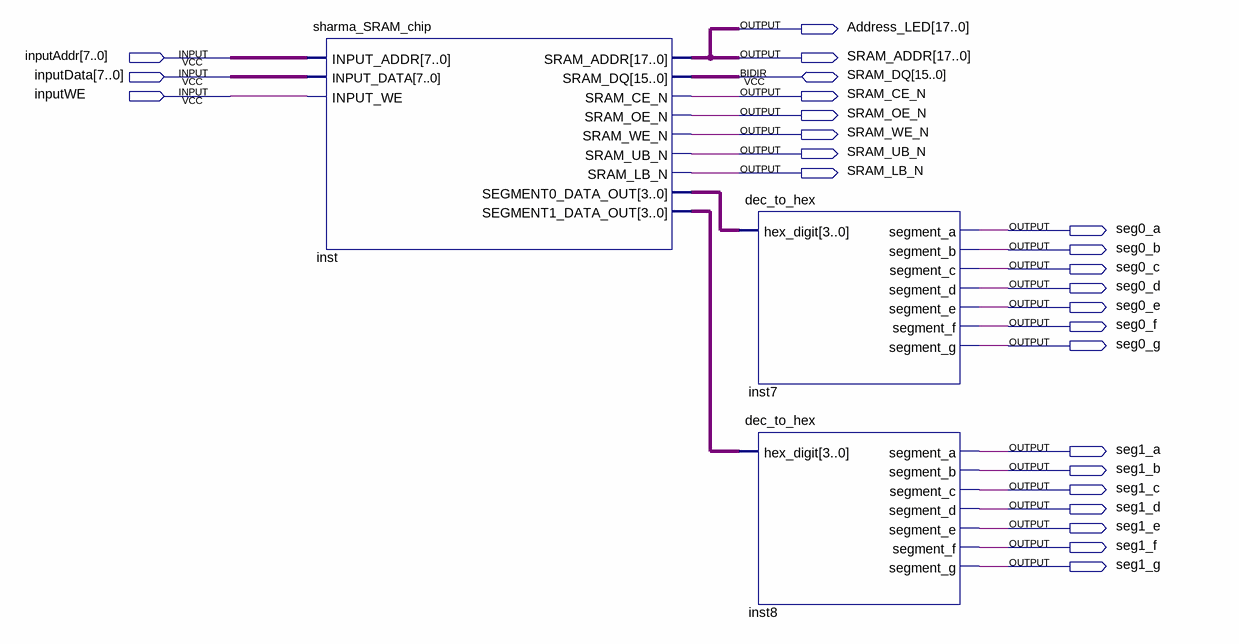
[diagram p0: schematic sheet]
// Quartus schematic sharma_SRAM_chip_8x8_display.bdf as structural Verilog: 3 symbols, 25 pins
module sharma_SRAM_chip_8x8_display (
  input  [7:0] inputAddr,
  input  [7:0] inputData,
  input  inputWE,
  inout  [15:0] SRAM_DQ,
  output [17:0] Address_LED,
  output [17:0] SRAM_ADDR,
  output SRAM_CE_N,
  output SRAM_OE_N,
  output SRAM_WE_N,
  output SRAM_UB_N,
  output SRAM_LB_N,
  output seg0_a,
  output seg0_b,
  output seg0_c,
  output seg0_d,
  output seg0_e,
  output seg0_f,
  output seg0_g,
  output seg1_a,
  output seg1_b,
  output seg1_c,
  output seg1_d,
  output seg1_e,
  output seg1_f,
  output seg1_g
);

  wire [3:0] inst_segment0_data_out, inst_segment1_data_out;

  sharma_SRAM_chip inst (
    .INPUT_ADDR(inputAddr), .INPUT_DATA(inputData), .INPUT_WE(inputWE), .SRAM_ADDR(Address_LED),
    .SRAM_CE_N(SRAM_CE_N), .SRAM_OE_N(SRAM_OE_N), .SRAM_WE_N(SRAM_WE_N), .SRAM_UB_N(SRAM_UB_N),
    .SRAM_LB_N(SRAM_LB_N), .SEGMENT0_DATA_OUT(inst_segment0_data_out),
    .SEGMENT1_DATA_OUT(inst_segment1_data_out), .SRAM_DQ(SRAM_DQ));
  dec_to_hex inst7 (
    .hex_digit(inst_segment0_data_out), .segment_a(seg0_a), .segment_b(seg0_b), .segment_c(seg0_c),
    .segment_d(seg0_d), .segment_e(seg0_e), .segment_f(seg0_f), .segment_g(seg0_g));
  dec_to_hex inst8 (
    .hex_digit(inst_segment1_data_out), .segment_a(seg1_a), .segment_b(seg1_b), .segment_c(seg1_c),
    .segment_d(seg1_d), .segment_e(seg1_e), .segment_f(seg1_f), .segment_g(seg1_g));

  assign SRAM_ADDR = Address_LED;
endmodule
